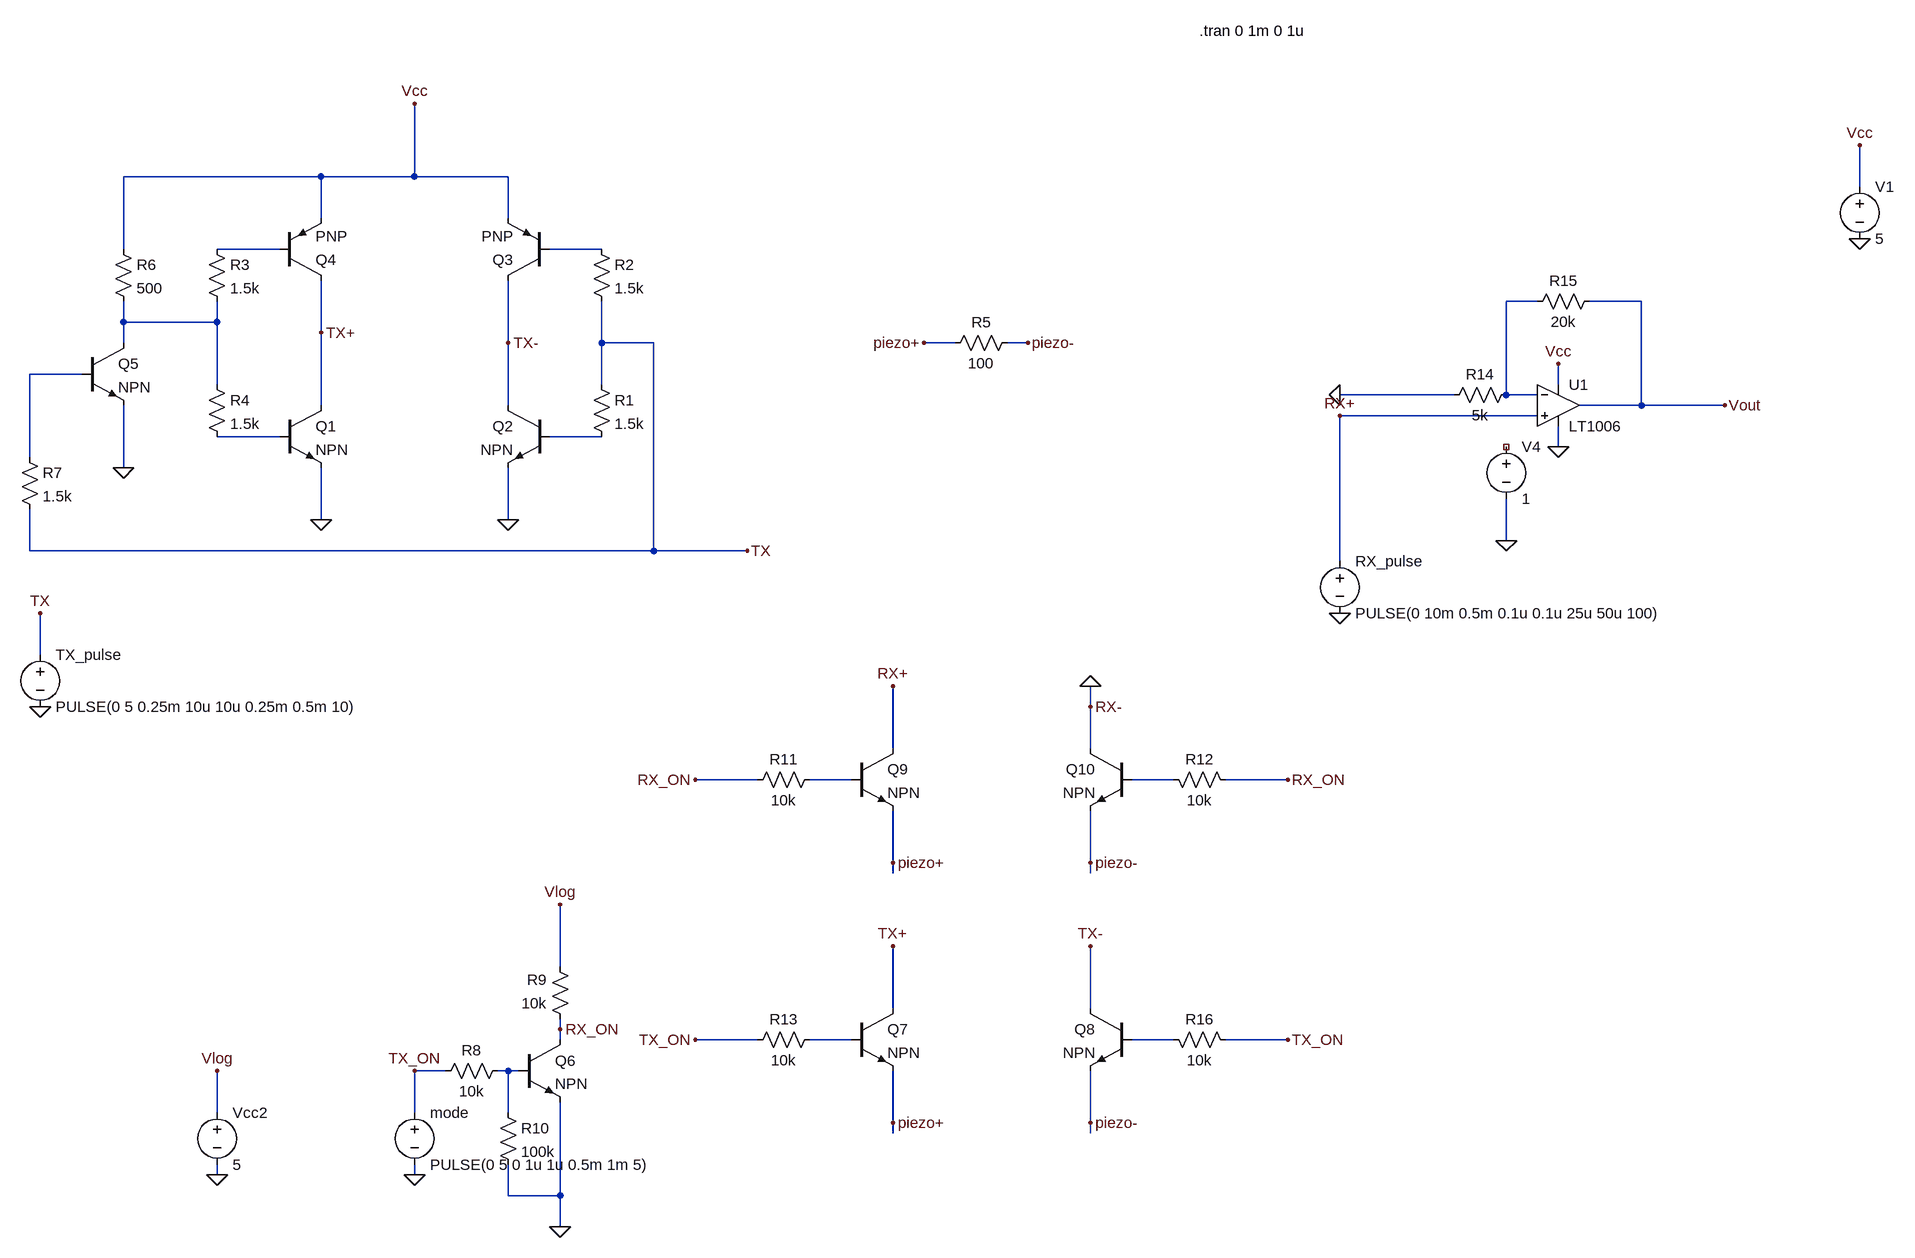
[diagram p0: schematic switched_TX.asc]
switched_TX.asc, the LTspice schematic file:
Version 4
SHEET 1 1580 1120
WIRE -848 -512 -1152 -512
WIRE -704 -512 -704 -624
WIRE -704 -512 -848 -512
WIRE -560 -512 -704 -512
WIRE 1520 -496 1520 -560
WIRE -848 -448 -848 -512
WIRE -560 -448 -560 -512
WIRE -1152 -400 -1152 -512
WIRE -912 -400 -1008 -400
WIRE -416 -400 -496 -400
WIRE 1024 -320 976 -320
WIRE 1184 -320 1104 -320
WIRE -1152 -288 -1152 -320
WIRE -1008 -288 -1008 -320
WIRE -1008 -288 -1152 -288
WIRE -848 -272 -848 -352
WIRE -1152 -256 -1152 -288
WIRE -560 -256 -560 -352
WIRE -416 -256 -416 -320
WIRE -336 -256 -416 -256
WIRE 128 -256 80 -256
WIRE 240 -256 208 -256
WIRE -1216 -208 -1296 -208
WIRE -1008 -192 -1008 -288
WIRE -416 -192 -416 -256
WIRE 1056 -192 1056 -224
WIRE 896 -176 720 -176
WIRE 976 -176 976 -320
WIRE 1024 -176 976 -176
WIRE -848 -160 -848 -272
WIRE -560 -160 -560 -256
WIRE 1184 -160 1184 -320
WIRE 1184 -160 1088 -160
WIRE 1312 -160 1184 -160
WIRE 1024 -144 720 -144
WIRE -912 -112 -1008 -112
WIRE -416 -112 -496 -112
WIRE 1056 -96 1056 -128
WIRE -1296 -80 -1296 -208
WIRE -1152 -64 -1152 -160
WIRE -848 16 -848 -64
WIRE -560 16 -560 -64
WIRE 976 48 976 -16
WIRE -1296 64 -1296 0
WIRE -336 64 -336 -256
WIRE -336 64 -1296 64
WIRE -192 64 -336 64
WIRE 720 80 720 -144
WIRE -1280 224 -1280 160
WIRE 336 304 336 272
WIRE 32 368 32 272
WIRE 336 368 336 304
WIRE -176 416 -272 416
WIRE -32 416 -96 416
WIRE 464 416 400 416
WIRE 640 416 544 416
WIRE 32 544 32 464
WIRE 336 544 336 464
WIRE 32 560 32 544
WIRE 336 560 336 544
WIRE -480 704 -480 608
WIRE 32 768 32 672
WIRE 336 768 336 672
WIRE -480 800 -480 784
WIRE -480 816 -480 800
WIRE -176 816 -272 816
WIRE -32 816 -96 816
WIRE 464 816 400 816
WIRE 640 816 544 816
WIRE -656 864 -704 864
WIRE -560 864 -576 864
WIRE -544 864 -560 864
WIRE -1008 928 -1008 864
WIRE -704 928 -704 864
WIRE -560 928 -560 864
WIRE 32 944 32 864
WIRE 336 944 336 864
WIRE 32 960 32 944
WIRE 336 960 336 944
WIRE -1008 1024 -1008 1008
WIRE -704 1024 -704 1008
WIRE -560 1056 -560 1008
WIRE -480 1056 -480 912
WIRE -480 1056 -560 1056
WIRE -480 1104 -480 1056
FLAG -560 16 0
FLAG -848 16 0
FLAG -1152 -64 0
FLAG 1520 -416 0
FLAG -1280 304 0
FLAG 1520 -560 Vcc
FLAG -704 -624 Vcc
FLAG -1280 160 TX
FLAG -192 64 TX
FLAG -704 1024 0
FLAG -704 864 TX_ON
FLAG -480 608 Vlog
FLAG -480 1104 0
FLAG -480 800 RX_ON
FLAG -1008 1024 0
FLAG -1008 864 Vlog
FLAG -272 816 TX_ON
FLAG 640 816 TX_ON
FLAG -848 -272 TX+
FLAG -560 -256 TX-
FLAG 80 -256 piezo+
FLAG 240 -256 piezo-
FLAG 32 672 TX+
FLAG 336 672 TX-
FLAG 32 944 piezo+
FLAG 336 944 piezo-
FLAG -272 416 RX_ON
FLAG 640 416 RX_ON
FLAG 32 272 RX+
FLAG 32 544 piezo+
FLAG 336 544 piezo-
FLAG 336 272 0
FLAG 336 304 RX-
FLAG 720 160 0
FLAG 1056 -224 Vcc
FLAG 1056 -96 0
FLAG 976 48 0
FLAG 1312 -160 Vout
FLAG 720 -176 0
FLAG 720 -144 RX+
SYMBOL npn -912 -160 R0
SYMATTR InstName Q1
SYMBOL npn -496 -160 M0
SYMATTR InstName Q2
SYMBOL pnp -496 -352 R180
SYMATTR InstName Q3
SYMBOL pnp -912 -352 M180
SYMATTR InstName Q4
SYMBOL res -432 -208 R0
SYMATTR InstName R1
SYMATTR Value 1.5k
SYMBOL res -432 -416 R0
SYMATTR InstName R2
SYMATTR Value 1.5k
SYMBOL res -1024 -416 R0
SYMATTR InstName R3
SYMATTR Value 1.5k
SYMBOL res -1024 -208 R0
SYMATTR InstName R4
SYMATTR Value 1.5k
SYMBOL res 224 -272 R90
WINDOW 0 0 56 VBottom 2
WINDOW 3 32 56 VTop 2
SYMATTR InstName R5
SYMATTR Value 100
SYMBOL res -1168 -416 R0
SYMATTR InstName R6
SYMATTR Value 500
SYMBOL npn -1216 -256 R0
SYMATTR InstName Q5
SYMBOL res -1312 -96 R0
SYMATTR InstName R7
SYMATTR Value 1.5k
SYMBOL voltage 1520 -512 R0
SYMATTR InstName V1
SYMATTR Value 5
SYMBOL voltage -1280 208 R0
SYMATTR InstName TX_pulse
SYMATTR Value PULSE(0 5 0.25m 10u 10u 0.25m 0.5m 10)
SYMBOL npn -544 816 R0
SYMATTR InstName Q6
SYMBOL res -560 848 R90
WINDOW 0 0 56 VBottom 2
WINDOW 3 32 56 VTop 2
SYMATTR InstName R8
SYMATTR Value 10k
SYMBOL res -464 800 R180
WINDOW 0 36 76 Left 2
WINDOW 3 36 40 Left 2
SYMATTR InstName R9
SYMATTR Value 10k
SYMBOL voltage -704 912 R0
SYMATTR InstName mode
SYMATTR Value PULSE(0 5 0 1u 1u 0.5m 1m 5)
SYMBOL res -576 912 R0
SYMATTR InstName R10
SYMATTR Value 100k
SYMBOL npn -32 768 R0
SYMATTR InstName Q7
SYMBOL res -80 800 R90
WINDOW 0 0 56 VBottom 2
WINDOW 3 32 56 VTop 2
SYMATTR InstName R13
SYMATTR Value 10k
SYMBOL npn 400 768 M0
SYMATTR InstName Q8
SYMBOL res 448 800 M90
WINDOW 0 0 56 VBottom 2
WINDOW 3 32 56 VTop 2
SYMATTR InstName R16
SYMATTR Value 10k
SYMBOL voltage -1008 912 R0
SYMATTR InstName Vcc2
SYMATTR Value 5
SYMBOL npn -32 368 R0
SYMATTR InstName Q9
SYMBOL res -80 400 R90
WINDOW 0 0 56 VBottom 2
WINDOW 3 32 56 VTop 2
SYMATTR InstName R11
SYMATTR Value 10k
SYMBOL npn 400 368 M0
SYMATTR InstName Q10
SYMBOL res 448 400 M90
WINDOW 0 0 56 VBottom 2
WINDOW 3 32 56 VTop 2
SYMATTR InstName R12
SYMATTR Value 10k
SYMBOL voltage 720 64 R0
SYMATTR InstName RX_pulse
SYMATTR Value PULSE(0 10m 0.5m 0.1u 0.1u 25u 50u 100)
SYMBOL LT1006 1056 -224 R0
SYMATTR InstName U1
SYMBOL res 992 -192 R90
WINDOW 0 0 56 VBottom 2
WINDOW 3 32 56 VTop 2
SYMATTR InstName R14
SYMATTR Value 5k
SYMBOL res 1120 -336 R90
WINDOW 0 0 56 VBottom 2
WINDOW 3 32 56 VTop 2
SYMATTR InstName R15
SYMATTR Value 20k
SYMBOL voltage 976 -112 R0
SYMATTR InstName V4
SYMATTR Value 1
TEXT 504 -736 Left 2 !.tran 0 1m 0 1u

The netlist it stands for:
* switched_TX.asc
Q1 TX+ N006 0 0 NPN
Q2 TX- N007 0 0 NPN
Q3 TX- N002 Vcc 0 PNP
Q4 TX+ N001 Vcc 0 PNP
R1 TX N007 1.5k
R2 N002 TX 1.5k
R3 N001 N004 1.5k
R4 N004 N006 1.5k
R5 piezo- piezo+ 100
R6 Vcc N004 500
Q5 N004 N005 0 0 NPN
R7 N005 TX 1.5k
V1 Vcc 0 5
V§TX_pulse TX 0 PULSE(0 5 0.25m 10u 10u 0.25m 0.5m 10)
Q6 RX_ON N012 0 0 NPN
R8 N012 TX_ON 10k
R9 RX_ON Vlog 10k
V§mode TX_ON 0 PULSE(0 5 0 1u 1u 0.5m 1m 5)
R10 N012 0 100k
Q7 TX+ N010 piezo+ 0 NPN
R13 N010 TX_ON 10k
Q8 TX- N011 piezo- 0 NPN
R16 N011 TX_ON 10k
Vcc2 Vlog 0 5
Q9 RX+ N008 piezo+ 0 NPN
R11 N008 RX_ON 10k
Q10 0 N009 piezo- 0 NPN
R12 N009 RX_ON 10k
V§RX_pulse RX+ 0 PULSE(0 10m 0.5m 0.1u 0.1u 25u 50u 100)
XU1 RX+ N003 Vcc 0 Vout LT1006  ; pins In+ In- V+ V- OUT
R14 N003 0 5k
R15 Vout N003 20k
V4 NC_01 0 1
.model NPN NPN
.model PNP PNP
.lib standard.bjt
.tran 0 1m 0 1u
.lib LTC.lib
.backanno
.end